# Altium schematic sheet RTM_Connectors.SchDoc
size A3; Organization: Altium Limited; Address1: L3, 12a Rodborough Rd; Address2: Frenchs Forest; Address3: NSW; Address4: Australia 2086
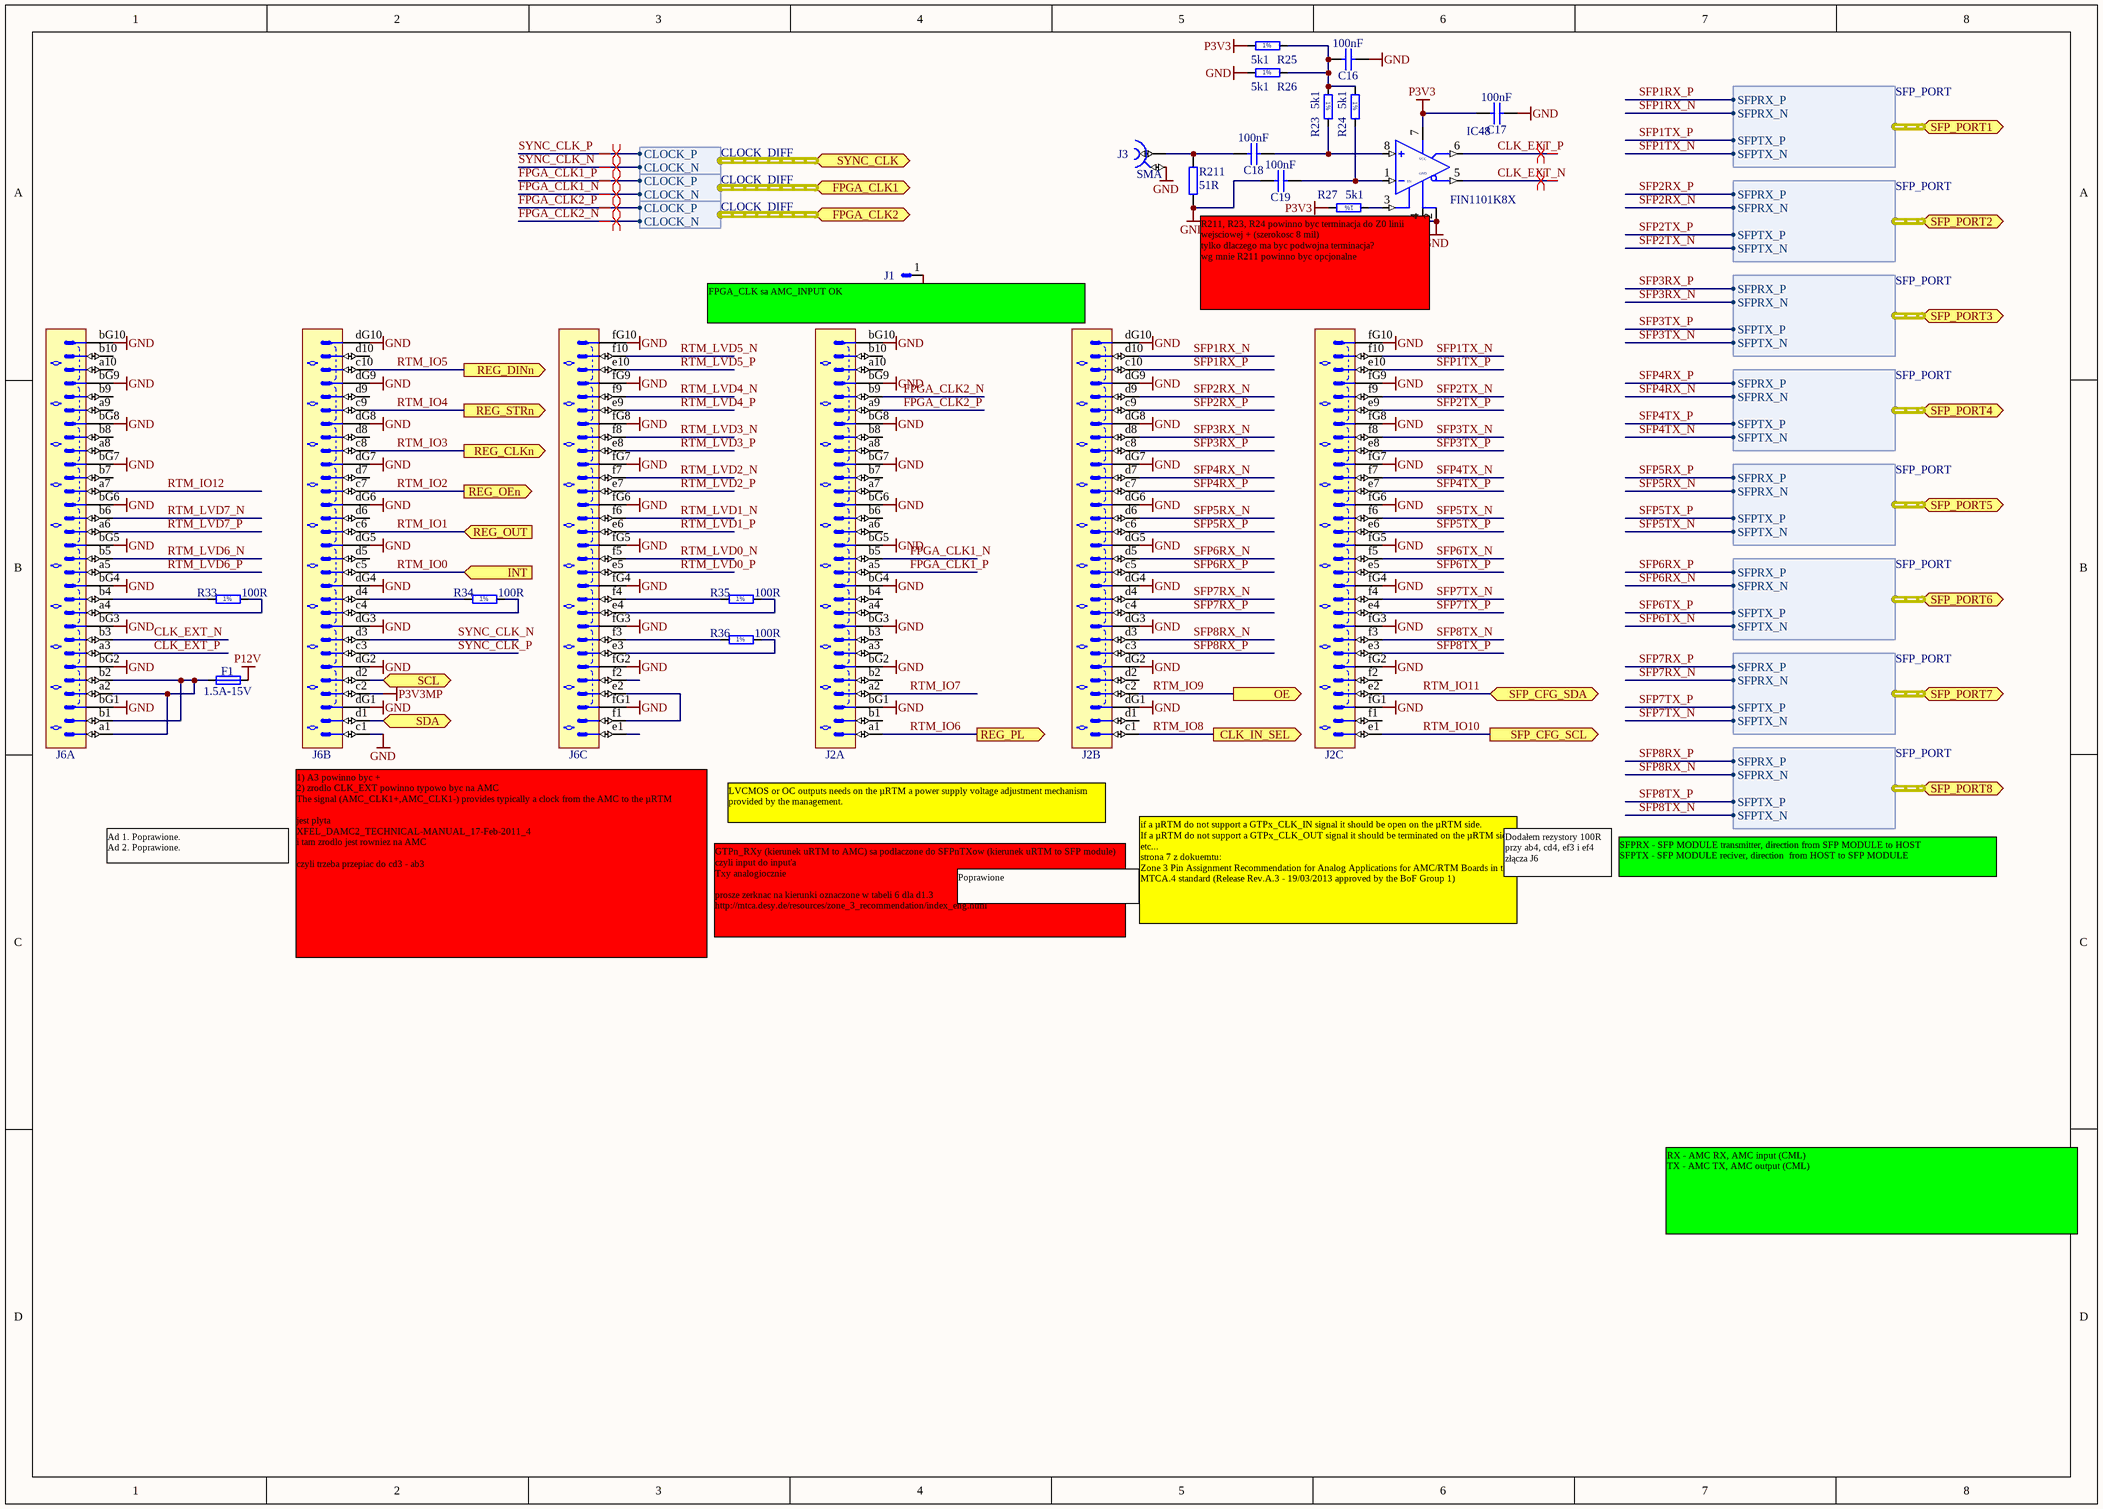
[diagram p0: RTM_Connectors.SchDoc]

## Parts
C16  100nF  [CAPC1005X55N]
C17  100nF  [CAPC1005X55N]
C18  100nF  [CAPC1005X55N]
C19  100nF  [CAPC1005X55N]
F1  1.5A-15V  [FUSR_TYCO_SMD150F-2]
IC48  FIN1101K8X  [US8]
J1  (no value)  [TYCO_1469265-1]
J2  (no value)  [TYCO_6469183-1]  (parts A,B,C of 3)
J3  SMA  [HUBER-SUHNER_85 SMA-50-0-101/111 NE]
J6  (no value)  [TYCO_6469183-1]  (parts A,B,C of 3)
R23  5k1  [RESC1608X55N]
R24  5k1  [RESC1608X55N]
R25  5k1  [RESC1608X55N]
R26  5k1  [RESC1608X55N]
R27  5k1  [RESC1608X55N]
R33  100R  [RESC1608X55N]
R34  100R  [RESC1608X55N]
R35  100R  [RESC1608X55N]
R36  100R  [RESC1608X55N]
R211  51R  [0402R]

## Ports
CLK_IN_SEL (out), FPGA_CLK1 (harness CLOCK_DIFF), FPGA_CLK2 (harness CLOCK_DIFF), INT (in), OE (out), REG_CLKn (out), REG_DINn (out), REG_OEn (out), REG_OUT (in), REG_PL (out), REG_STRn (out), SCL (bidir), SDA (bidir), SFP_CFG_SCL (out), SFP_CFG_SDA (bidir), SFP_PORT1 (harness SFP_PORT), SFP_PORT2 (harness SFP_PORT), SFP_PORT3 (harness SFP_PORT), SFP_PORT4 (harness SFP_PORT), SFP_PORT5 (harness SFP_PORT), SFP_PORT6 (harness SFP_PORT), SFP_PORT7 (harness SFP_PORT), SFP_PORT8 (harness SFP_PORT), SYNC_CLK (harness CLOCK_DIFF)

## Harnesses
SFP_PORT: SFPRX_P, SFPRX_N, SFPTX_P, SFPTX_N
CLOCK_DIFF: CLOCK_P, CLOCK_N

## Nets
GND: C16.2 C17.2 C19.1 IC48.2(GND) IC48.4(GND) J1.1 J2.bG1 J2.bG2 J2.bG3 J2.bG4 J2.bG5 J2.bG6 J2.bG7 J2.bG8 J2.bG9 J2.bG10 J2.dG1 J2.dG2 J2.dG3 J2.dG4 J2.dG5 J2.dG6 J2.dG7 J2.dG8 J2.dG9 J2.dG10 J2.fG1 J2.fG2 J2.fG3 J2.fG4 J2.fG5 J2.fG6 J2.fG7 J2.fG8 J2.fG9 J2.fG10 J3.2 J6.bG1 J6.bG2 J6.bG3 J6.bG4 J6.bG5 J6.bG6 J6.bG7 J6.bG8 J6.bG9 J6.bG10 J6.c1 J6.dG1 J6.dG2 J6.dG3 J6.dG4 J6.dG5 J6.dG6 J6.dG7 J6.dG8 J6.dG9 J6.dG10 J6.fG1 J6.fG2 J6.fG3 J6.fG4 J6.fG5 J6.fG6 J6.fG7 J6.fG8 J6.fG9 J6.fG10 R26.1 R211.2
P3V3: C17.1 IC48.7(VCC) R25.1 R27.2
P3V3MP: J6.c2
P12V: F1.2
CLK_EXT_N: IC48.5(~{Q}) J6.b3
CLK_EXT_P: IC48.6(Q) J6.a3
FPGA_CLK1_N: J2.b5 ; port FPGA_CLK1.CLOCK_N
FPGA_CLK1_P: J2.a5 ; port FPGA_CLK1.CLOCK_P
FPGA_CLK2_N: J2.b9 ; port FPGA_CLK2.CLOCK_N
FPGA_CLK2_P: J2.a9 ; port FPGA_CLK2.CLOCK_P
RTM_IO0: J6.c5 ; port INT
RTM_IO1: J6.c6 ; port REG_OUT
RTM_IO2: J6.c7 ; port REG_OEn
RTM_IO3: J6.c8 ; port REG_CLKn
RTM_IO4: J6.c9 ; port REG_STRn
RTM_IO5: J6.c10 ; port REG_DINn
RTM_IO6: J2.a1 ; port REG_PL
RTM_IO7: J2.a2
RTM_IO8: J2.c1 ; port CLK_IN_SEL
RTM_IO9: J2.c2 ; port OE
RTM_IO10: J2.e1 ; port SFP_CFG_SCL
RTM_IO11: J2.e2 ; port SFP_CFG_SDA
RTM_IO12: J6.a7
RTM_LVD0_N: J6.f5
RTM_LVD0_P: J6.e5
RTM_LVD1_N: J6.f6
RTM_LVD1_P: J6.e6
RTM_LVD2_N: J6.f7
RTM_LVD2_P: J6.e7
RTM_LVD3_N: J6.f8
RTM_LVD3_P: J6.e8
RTM_LVD4_N: J6.f9
RTM_LVD4_P: J6.e9
RTM_LVD5_N: J6.f10
RTM_LVD5_P: J6.e10
RTM_LVD6_N: J6.b5
RTM_LVD6_P: J6.a5
RTM_LVD7_N: J6.b6
RTM_LVD7_P: J6.a6
SCL: J6.d2 ; port SCL
SDA: J6.d1 ; port SDA
SFP1RX_N: J2.d10 ; port SFP_PORT1.SFPRX_N
SFP1RX_P: J2.c10 ; port SFP_PORT1.SFPRX_P
SFP1TX_N: J2.f10 ; port SFP_PORT1.SFPTX_N
SFP1TX_P: J2.e10 ; port SFP_PORT1.SFPTX_P
SFP2RX_N: J2.d9 ; port SFP_PORT2.SFPRX_N
SFP2RX_P: J2.c9 ; port SFP_PORT2.SFPRX_P
SFP2TX_N: J2.f9 ; port SFP_PORT2.SFPTX_N
SFP2TX_P: J2.e9 ; port SFP_PORT2.SFPTX_P
SFP3RX_N: J2.d8 ; port SFP_PORT3.SFPRX_N
SFP3RX_P: J2.c8 ; port SFP_PORT3.SFPRX_P
SFP3TX_N: J2.f8 ; port SFP_PORT3.SFPTX_N
SFP3TX_P: J2.e8 ; port SFP_PORT3.SFPTX_P
SFP4RX_N: J2.d7 ; port SFP_PORT4.SFPRX_N
SFP4RX_P: J2.c7 ; port SFP_PORT4.SFPRX_P
SFP4TX_N: J2.f7 ; port SFP_PORT4.SFPTX_N
SFP4TX_P: J2.e7 ; port SFP_PORT4.SFPTX_P
SFP5RX_N: J2.d6 ; port SFP_PORT5.SFPRX_N
SFP5RX_P: J2.c6 ; port SFP_PORT5.SFPRX_P
SFP5TX_N: J2.f6 ; port SFP_PORT5.SFPTX_N
SFP5TX_P: J2.e6 ; port SFP_PORT5.SFPTX_P
SFP6RX_N: J2.d5 ; port SFP_PORT6.SFPRX_N
SFP6RX_P: J2.c5 ; port SFP_PORT6.SFPRX_P
SFP6TX_N: J2.f5 ; port SFP_PORT6.SFPTX_N
SFP6TX_P: J2.e5 ; port SFP_PORT6.SFPTX_P
SFP7RX_N: J2.d4 ; port SFP_PORT7.SFPRX_N
SFP7RX_P: J2.c4 ; port SFP_PORT7.SFPRX_P
SFP7TX_N: J2.f4 ; port SFP_PORT7.SFPTX_N
SFP7TX_P: J2.e4 ; port SFP_PORT7.SFPTX_P
SFP8RX_N: J2.d3 ; port SFP_PORT8.SFPRX_N
SFP8RX_P: J2.c3 ; port SFP_PORT8.SFPRX_P
SFP8TX_N: J2.f3 ; port SFP_PORT8.SFPTX_N
SFP8TX_P: J2.e3 ; port SFP_PORT8.SFPTX_P
SYNC_CLK_N: J6.d3 ; port SYNC_CLK.CLOCK_N
SYNC_CLK_P: J6.c3 ; port SYNC_CLK.CLOCK_P
NetC16_1: C16.1 R23.1 R24.1 R25.2 R26.2
NetC18_1: C18.1 J3.1 R211.1
NetC18_2: C18.2 IC48.8(IN) R23.2
NetC19_2: C19.2 IC48.1(IN) R24.2
NetF1_1: F1.1 J6.a1 J6.a2 J6.b1 J6.b2
NetIC48_3: IC48.3(EN) R27.1
NetJ6_a4: J6.a4 R33.2
NetJ6_b4: J6.b4 R33.1
NetJ6_c4: J6.c4 R34.2
NetJ6_d4: J6.d4 R34.1
NetJ6_e2: J6.e2 J6.f1
NetJ6_e3: J6.e3 R36.2
NetJ6_e4: J6.e4 R35.2
NetJ6_f3: J6.f3 R36.1
NetJ6_f4: J6.f4 R35.1

Not connected (* = marked no-connect by the designer): J2 a3 a4 a6 a7 a8 a10 b1 b2 b3 b4 b6 b7 b8 b10 d1 d2 f1 f2; J6 a8 a9 a10 b7 b8 b9 b10 d5 d6 d7 d8 d9 d10 e1 f2

## Layout directives
differential pair: CLK_EXT_N, CLK_EXT_P, FPGA_CLK1_N, FPGA_CLK1_P, FPGA_CLK2_N, FPGA_CLK2_P, SYNC_CLK_N, SYNC_CLK_P

## Notes on the sheet
- (near J1) FPGA_CLK sa AMC_INPUT OK
- R211, R23, R24 powinno byc terminacja do Z0 linii wejsciowej + (szerokosc 8 mil)
  tylko dlaczego ma byc podwojna terminacja?
  wg mnie R211 powinno byc opcjonalne
- Ad 1. Poprawione.
  Ad 2. Poprawione.
- (near J2) LVCMOS or OC outputs needs on the µRTM a power supply voltage adjustment mechanism provided by the management.
- Poprawione
- if a µRTM do not support a GTPx_CLK_IN signal it should be open on the µRTM side.
  If a µRTM do not support a GTPx_CLK_OUT signal it should be terminated on the µRTM side.
  etc...
  strona 7 z dokuemtu:
  Zone 3 Pin Assignment Recommendation for Analog Applications for AMC/RTM Boards in the MTCA.4 standard (Release Rev.A.3 - 19/03/2013 approved by the BoF Group 1)
- Dodałem rezystory 100R przy ab4, cd4, ef3 i ef4 złącza J6
- SFPRX - SFP MODULE transmitter, direction from SFP MODULE to HOST
  SFPTX - SFP MODULE reciver, direction  from HOST to SFP MODULE
- (near J6) 1) A3 powinno byc +
  2) zrodlo CLK_EXT powinno typowo byc na AMC
  The signal (AMC_CLK1+,AMC_CLK1-) provides typically a clock from the AMC to the µRTM
  jest plyta
  XFEL_DAMC2_TECHNICAL-MANUAL_17-Feb-2011_4
  i tam zrodlo jest rowniez na AMC
  czyli trzeba przepiac do cd3 - ab3
- GTPn_RXy (kierunek uRTM to AMC) sa podlaczone do SFPnTXow (kierunek uRTM to SFP module)
  czyli input do input'a
  Txy analogiocznie
  prosze zerknac na kierunki oznaczone w tabeli 6 dla d1.3
  http://mtca.desy.de/resources/zone_3_recommendation/index_eng.html
- RX - AMC RX, AMC input (CML)
  TX - AMC TX, AMC output (CML)
- (in symbol R0603_5K1_1%_0.1W_100PPM) 1%

## Library data of the parts
C16-C19 = CC0402_100NF_16V_10%_X7R: Non-polarised capacitor; Part Description: SMD Multilayer Chip Ceramic Capacitor; Manufacturer: GENERIC; Manufacturer1 Part Number: 223878715649; Voltage: 16V; TC: X7R; Tolerance: ±10%; Table: Capacitors SMD; Part Number: CC0402_100NF_16V_10%_X7R; Component Kind: Standard; Component Type: Standard; Pin Count: 2; Value: 100nF; Status: Not Recommended; Manufacturer Part Number: CC0402_100NF_16V_10%_X7R; Case: 0402; Mounted: Yes; Socket: No; SMD: Yes; Manufacturer1 Example: PHYCOMP; Manufacturer1 ComponentHeight: 0.55mm; HelpURL: \\cern.ch\dfs\Applications\Altium\Datasheets\CC0402_X7R_PHYCOMP.pdf; Author: CERN DEM JLC; CreateDate: 12/3/2007; LatestRevisionDate: 12/3/2007
F1 = FUSR_TYCO_SMD150F-2: Fuse; Part Description: PolySwitch® PTC Overcurrent Protection Device; Manufacturer: TYCO ELECTRONICS; Table: Fuses; Part Number: FUSR_TYCO_SMD150F-2; Component Kind: Standard; Component Type: Standard; Pin Count: 2; PackageDescription: PolySwitch, 2-Leads, Body 8.7x6.35mm Nominal; Family: Fuses Resettable; Mounted: Yes; Socket: No; SMD: Yes; Value: 1.5A-15V; Manufacturer Part Number: SMD150F-2; ComponentHeight: 3mm; HelpURL: \\cern.ch\dfs\Applications\Altium\Datasheets\FUSR_TYCO_SMD150F-2.pdf; Author: CERN DEM JLC; CreateDate: 2010-03-17; LatestRevisionDate: 2010-03-17
IC48 = IFC_FIN1101K8X: LVDS TO LVDS repeater3.3V
J1 = TYCO_1469265-1: Single Pin Male; Part Number: TYCO_1469265-1
J2 J6 = TYCO_6469183-1: Connector 60 ATCA Male 30 Pairs (60 Signals) + 3x10 Ground; Part Number: TYCO_6469183-1
J3 = HUBER-SUHNER_85_SMA-50-0-101/111_NE: Part Description: SMA 50 Ohms Right Angle PCB Jack; Manufacturer: HUBER+SUHNER; Table: Miscellaneous; Part Number: HUBER-SUHNER_85_SMA-50-0-101/111_NE; Component Kind: Standard; Component Type: Standard; Pin Count: 2; Family: SMA; Mounted: Yes; Socket: No; SMD: No; Status: None; Manufacturer Part Number: 85_SMA-50-0-101/111_NE; ComponentHeight: 9.6mm; HelpURL: \\cern.ch\dfs\Applications\Altium\Datasheets\HUBER-SUHNER_85 SMA-50-0-101-111 NE.pdf; Author: CERN DEM JLC; CreateDate: 2010-04-20; LatestRevisionDate: 2010-04-27
R23-R27 R33-R36 = R0603_5K1_1%_0.1W_100PPM: Resistor - 1%; Part Description: General Purpose Thick Film Chip Resistor; Manufacturer: GENERIC; Manufacturer1 Part Number: NRC06F5101TRF; Power: 0.1W; TC: ±100ppm/°C; Table: Resistors SMD; Part Number: R0603_5K1_1%_0.1W_100PPM; Component Kind: Standard; Component Type: Standard; Pin Count: 2; Status: Preferred; Tolerance: ±1%; Manufacturer Part Number: R0603_5K1_1%_0.1W_100PPM; Case: 0603; Mounted: Yes; Socket: No; SMD: Yes; Manufacturer1 Example: NIC COMPONENT; Manufacturer1 ComponentHeight: 0.55mm; HelpURL: \\cern.ch\dfs\Applications\Altium\Datasheets\R0603_NIC_NRC.pdf; Author: CERN DEM JLC; CreateDate: 03/12/2007; LatestRevisionDate: 13/03/2008
  R23-R27: Value: 5k1
  R33-R36: Value: 100R
R211 = RES_0402: SMD Resistor; Supplier 1: Newark; Supplier Part Number 1: 59M6691